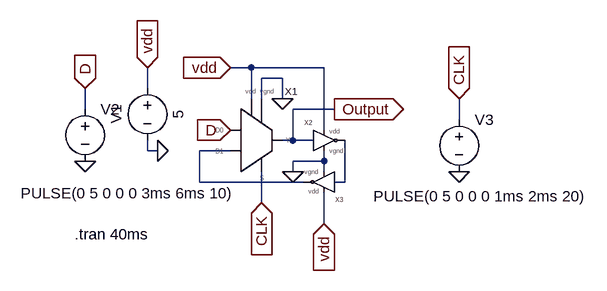
[diagram p0: schematic D Latch Using Multiplexer.asc]
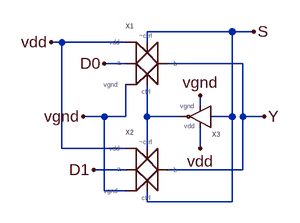
[diagram p1: sub-circuit mux_tg_2.asc]
D Latch Using Multiplexer.asc, the LTspice schematic file:
Version 4.1
SHEET 1 880 680
WIRE 192 64 160 64
WIRE 304 64 192 64
WIRE 240 80 208 80
WIRE 32 96 32 64
WIRE 192 112 192 64
WIRE 208 112 208 80
WIRE 240 112 240 80
WIRE -64 128 -64 96
WIRE 320 128 256 128
WIRE 512 144 512 112
WIRE 304 160 304 64
WIRE 256 176 256 128
WIRE 256 176 240 176
WIRE 288 176 256 176
WIRE 32 192 32 176
WIRE 48 192 32 192
WIRE 160 192 112 192
WIRE 304 208 304 192
WIRE 304 208 256 208
WIRE 256 224 256 208
WIRE 304 224 304 208
WIRE 112 240 112 192
WIRE 272 240 112 240
WIRE 336 240 336 176
WIRE 336 240 320 240
WIRE 208 272 208 224
WIRE 304 304 304 256
FLAG 240 112 0
FLAG 208 272 CLK
IOPIN 208 272 In
FLAG 48 192 0
FLAG 160 160 D
IOPIN 160 160 In
FLAG -64 96 D
IOPIN -64 96 In
FLAG -64 208 0
FLAG 512 224 0
FLAG 512 112 CLK
IOPIN 512 112 In
FLAG 160 64 vdd
IOPIN 160 64 In
FLAG 32 64 vdd
IOPIN 32 64 In
FLAG 304 304 vdd
IOPIN 304 304 In
FLAG 320 128 Output
IOPIN 320 128 Out
FLAG 256 224 0
SYMBOL Mux_TG_2 192 176 R0
SYMATTR InstName X1
SYMBOL voltage 32 80 R0
WINDOW 0 -32 56 VBottom 2
WINDOW 3 32 56 VTop 2
WINDOW 123 0 0 Left 0
WINDOW 39 0 0 Left 0
SYMATTR InstName V1
SYMATTR Value 5
SYMBOL voltage -64 112 R0
WINDOW 3 -99 145 Left 2
WINDOW 123 0 0 Left 0
WINDOW 39 0 0 Left 0
SYMATTR InstName V2
SYMATTR Value PULSE(0 5 0 0 0 3ms 6ms 10)
SYMBOL voltage 512 128 R0
WINDOW 3 -132 134 Left 2
WINDOW 123 0 0 Left 0
WINDOW 39 0 0 Left 0
SYMATTR InstName V3
SYMATTR Value PULSE(0 5 0 0 0 1ms 2ms 20)
SYMBOL CMOS_Inverter 304 176 R0
SYMATTR InstName X2
SYMBOL CMOS_Inverter 304 240 R180
SYMATTR InstName X3
TEXT -80 320 Left 2 !.tran 40ms

mux_tg_2.asc, the sub-circuit schematic file:
Version 4.1
SHEET 1 880 680
WIRE 352 64 224 64
WIRE 384 64 352 64
WIRE 96 80 80 80
WIRE 192 80 96 80
WIRE 224 80 224 64
WIRE 192 112 160 112
WIRE 368 112 256 112
WIRE 304 176 304 160
WIRE 160 192 128 192
WIRE 192 192 192 144
WIRE 192 192 160 192
WIRE 224 192 224 144
WIRE 272 192 224 192
WIRE 352 192 352 64
WIRE 352 192 320 192
WIRE 368 192 368 112
WIRE 400 192 368 192
WIRE 96 240 96 80
WIRE 192 240 96 240
WIRE 224 240 224 192
WIRE 304 240 304 208
WIRE 192 272 144 272
WIRE 368 272 368 192
WIRE 368 272 256 272
WIRE 160 304 160 192
WIRE 192 304 160 304
WIRE 224 320 224 304
WIRE 352 320 352 192
WIRE 352 320 224 320
FLAG 160 112 D0
FLAG 80 80 vdd
FLAG 144 272 D1
FLAG 384 64 S
FLAG 400 192 Y
FLAG 304 240 vdd
FLAG 128 192 vgnd
FLAG 304 160 vgnd
SYMBOL Transmission_Gate_2 224 96 R0
SYMATTR InstName X1
SYMBOL Transmission_Gate_2 224 256 R0
SYMATTR InstName X2
SYMBOL CMOS_Inverter 304 192 R180
SYMATTR InstName X3

The netlist it stands for:
* D Latch Using Multiplexer.asc
X§X1 D N001 Output CLK vdd 0 mux_tg_2
V1 vdd 0 5
V2 D 0 PULSE(0 5 0 0 0 3ms 6ms 10)
V3 CLK 0 PULSE(0 5 0 0 0 1ms 2ms 20)
X§X2 Output N002 vdd 0 CMOS_Inverter  ; pins i o vdd vgnd
X§X3 N002 N001 vdd 0 CMOS_Inverter  ; pins i o vdd vgnd

* block symbol definitions
.subckt mux_tg_2 D0 D1 Y S vdd vgnd
X§X1 vdd vgnd D0 Y N001 S Transmission_Gate_2  ; pins vdd vgnd a b ctrl ~ctrl
X§X2 vdd vgnd D1 Y S N001 Transmission_Gate_2  ; pins vdd vgnd a b ctrl ~ctrl
X§X3 S N001 vdd vgnd CMOS_Inverter  ; pins i o vdd vgnd
.ends mux_tg_2

.tran 40ms
.backanno
.end